# EAGLE schematic GB_Slave_2015 (EAGLE 7.1.0)
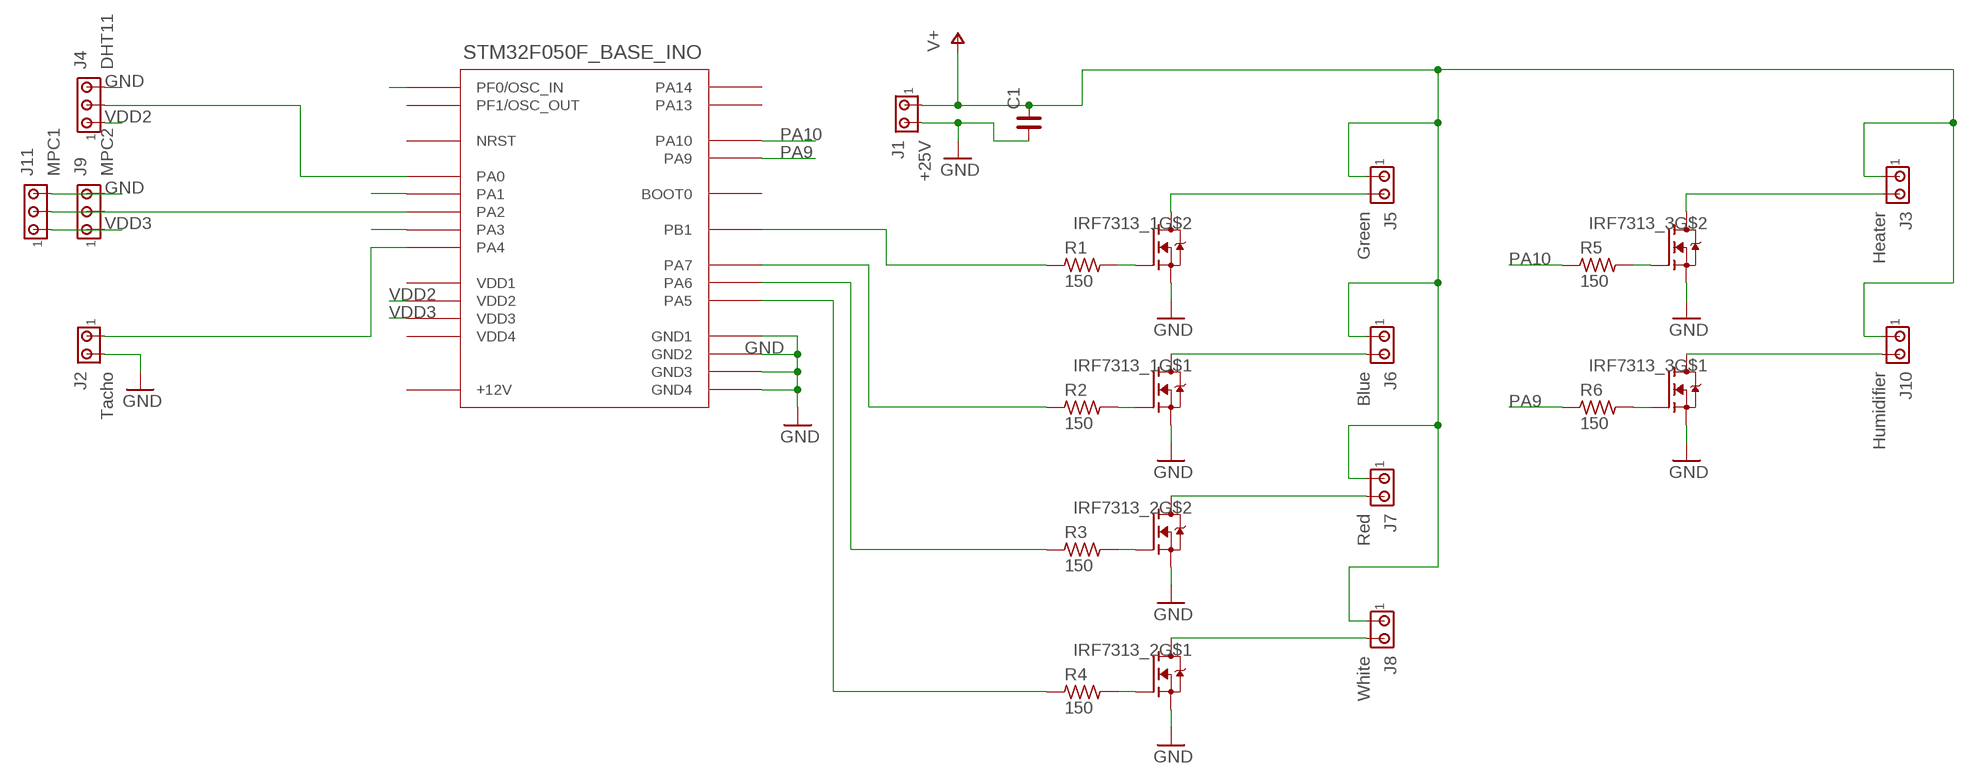
[diagram p0: schematic, sheet 1]

## Parts
C1  C_0603  [C0603]
IRF7313_1  IRF7313  [SO-8]
IRF7313_2  IRF7313  [SO-8]
IRF7313_3  IRF7313  [SO-8]
J1  +25V  MTA02-100  [10X02MTA]
J2  Tacho  MTA02-100  [10X02MTA]
J3  Heater  MTA02-100  [10X02MTA]
J4  DHT11  MTA03-100  [10X03MTA]
J5  Green  MTA02-100  [10X02MTA]
J6  Blue  MTA02-100  [10X02MTA]
J7  Red  MTA02-100  [10X02MTA]
J8  White  MTA02-100  [10X02MTA]
J9  MPC2  MTA03-100  [10X03MTA]
J10  Humidifier  MTA02-100  [10X02MTA]
J11  MPC1  MTA03-100  [10X03MTA]
R1  150  R_1206  [R1206]
R2  150  R_1206  [R1206]
R3  150  R_1206  [R1206]
R4  150  R_1206  [R1206]
R5  150  R_1206  [R1206]
R6  150  R_1206  [R1206]
STM321  STM32F050F_BASE_INO  [STM32_BASE_INO]

## Nets
GND [PWR]: C1.1 IRF7313_1.1(S) IRF7313_1.3(S) IRF7313_2.1(S) IRF7313_2.3(S) IRF7313_3.1(S) IRF7313_3.3(S) J1.2 J2.2 J4.3 J9.3 J11.3 STM321.GND1 STM321.GND2 STM321.GND3 STM321.GND4
N$1: R1.1 STM321.PB1
N$2 [PWR]: IRF7313_1.5(D) IRF7313_1.6(D) J5.2
N$3: J2.1 STM321.PA4
N$4: R4.1 STM321.PA5
N$5: IRF7313_1.4(G) R1.2
N$6: IRF7313_1.2(G) R2.2
N$7: IRF7313_2.2(G) R4.2
N$8: IRF7313_2.4(G) R3.2
N$9: R3.1 STM321.PA6
N$10: R2.1 STM321.PA7
N$11 [PWR]: IRF7313_3.5(D) IRF7313_3.6(D) J3.2
N$12 [PWR]: IRF7313_1.7(D) IRF7313_1.8(D) J6.2
N$13: IRF7313_3.4(G) R5.2
N$14 [PWR]: IRF7313_2.5(D) IRF7313_2.6(D) J7.2
N$15: IRF7313_3.2(G) R6.2
N$16 [PWR]: IRF7313_3.7(D) IRF7313_3.8(D) J10.2
N$17: J4.2 STM321.PA0
N$18: STM321.PF0(PF0/OSC_IN)
N$19 [PWR]: IRF7313_2.7(D) IRF7313_2.8(D) J8.2
N$20: STM321.PA1
N$21: J9.2 J11.2 STM321.PA2
N$22: STM321.PA3
PA9: R6.1 STM321.PA9
PA10: R5.1 STM321.PA10
V+ [PWR]: C1.2 J1.1 J3.1 J5.1 J6.1 J7.1 J8.1 J10.1
VDD2: J4.1 STM321.VDD2
VDD3: J9.1 J11.1 STM321.VDD3
Unconnected: STM321.+12V STM321.BOOT0 STM321.NRST STM321.PA13 STM321.PA14 STM321.PF1(PF1/OSC_OUT) STM321.VDD1 STM321.VDD4

## Library data of the parts
C1 = rc-master-smd:C_: NON-POLARIZED CAP
IRF7313_1-IRF7313_3 = my-library:IRF7313
J1-J3 J5-J8 J10 = con-amp:MTA02-100: AMP connector
J4 J9 J11 = con-amp:MTA03-100: AMP connector
R1-R6 = rc-master-smd:R_: RESISTOR
STM321 = my-library:STM32F050F_BASE_INO

## Net classes
1 PWR: width 0.635 mm, clearance 0.635 mm